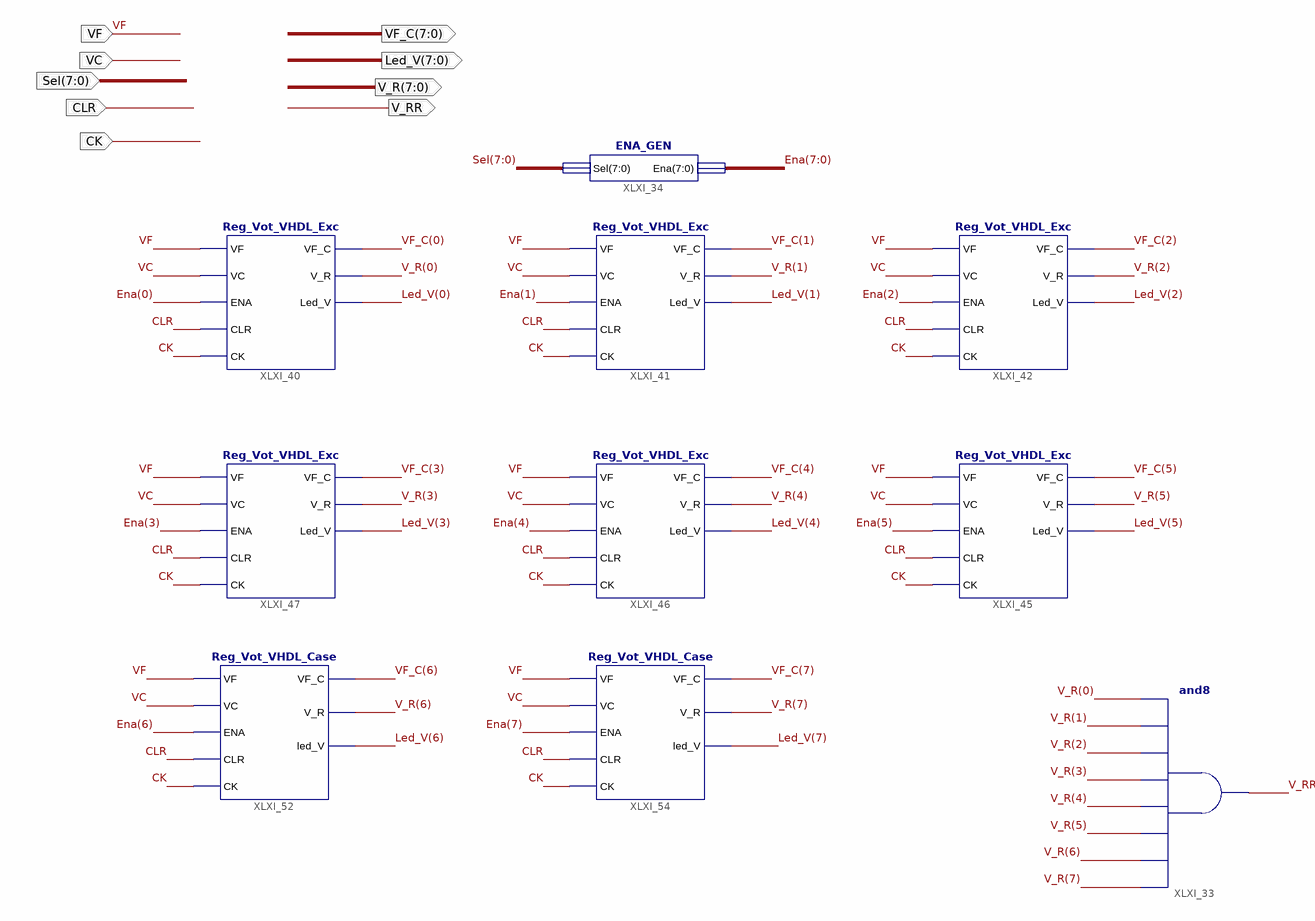
[diagram p0: schematic sheet 1]
// Xilinx ISE schematic Regs_Vot.sch (spartan6) as structural Verilog: 10 symbols, 9 ports
module Regs_Vot (
  input  VF,
  input  VC,
  input  CK,
  input  CLR,
  input  [7:0] Sel,
  output V_RR,
  output [7:0] VF_C,
  output [7:0] Led_V,
  output [7:0] V_R
);

  wire [7:0] Ena;

  and XLXI_33 (V_RR, V_R[7], V_R[6], V_R[5], V_R[4], V_R[3], V_R[2], V_R[1], V_R[0]);
  ENA_GEN XLXI_34 (.Ena(Ena), .Sel(Sel));
  Reg_Vot_VHDL_Exc XLXI_40 (
    .VF(VF), .VC(VC), .ENA(Ena[0]), .VF_C(VF_C[0]), .CK(CK), .CLR(CLR), .Led_V(Led_V[0]), .V_R(V_R[0]));
  Reg_Vot_VHDL_Exc XLXI_41 (
    .VF(VF), .VC(VC), .ENA(Ena[1]), .VF_C(VF_C[1]), .CK(CK), .CLR(CLR), .Led_V(Led_V[1]), .V_R(V_R[1]));
  Reg_Vot_VHDL_Exc XLXI_42 (
    .VF(VF), .VC(VC), .ENA(Ena[2]), .VF_C(VF_C[2]), .CK(CK), .CLR(CLR), .Led_V(Led_V[2]), .V_R(V_R[2]));
  Reg_Vot_VHDL_Exc XLXI_45 (
    .VF(VF), .VC(VC), .ENA(Ena[5]), .VF_C(VF_C[5]), .CK(CK), .CLR(CLR), .Led_V(Led_V[5]), .V_R(V_R[5]));
  Reg_Vot_VHDL_Exc XLXI_46 (
    .VF(VF), .VC(VC), .ENA(Ena[4]), .VF_C(VF_C[4]), .CK(CK), .CLR(CLR), .Led_V(Led_V[4]), .V_R(V_R[4]));
  Reg_Vot_VHDL_Exc XLXI_47 (
    .VF(VF), .VC(VC), .ENA(Ena[3]), .VF_C(VF_C[3]), .CK(CK), .CLR(CLR), .Led_V(Led_V[3]), .V_R(V_R[3]));
  Reg_Vot_VHDL_Case XLXI_52 (
    .VF(VF), .VC(VC), .ENA(Ena[6]), .CLR(CLR), .CK(CK), .VF_C(VF_C[6]), .V_R(V_R[6]), .led_V(Led_V[6]));
  Reg_Vot_VHDL_Case XLXI_54 (
    .VF(VF), .VC(VC), .ENA(Ena[7]), .CLR(CLR), .CK(CK), .VF_C(VF_C[7]), .V_R(V_R[7]), .led_V(Led_V[7]));
endmodule
